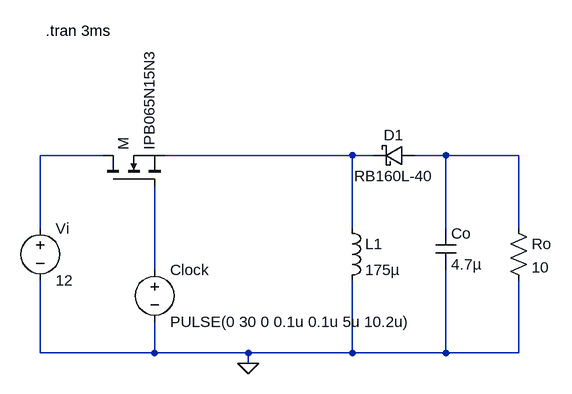
[diagram p0: schematic Buck-Boost Converter.asc]
Buck-Boost Converter.asc, the LTspice schematic file:
Version 4
SHEET 1 880 680
WIRE -288 -64 -384 -64
WIRE 96 -64 -192 -64
WIRE 128 -64 96 -64
WIRE 240 -64 192 -64
WIRE 352 -64 240 -64
WIRE -384 48 -384 -64
WIRE 96 48 96 -64
WIRE 240 48 240 -64
WIRE 352 48 352 -64
WIRE -208 112 -208 -16
WIRE -384 240 -384 128
WIRE -208 240 -208 192
WIRE -208 240 -384 240
WIRE -64 240 -208 240
WIRE 96 240 96 128
WIRE 96 240 -64 240
WIRE 240 240 240 112
WIRE 240 240 96 240
WIRE 352 240 352 128
WIRE 352 240 240 240
WIRE -64 256 -64 240
FLAG -64 256 0
SYMBOL nmos -288 -16 R270
SYMATTR InstName M
SYMATTR Value IPB065N15N3
SYMBOL cap 224 48 R0
SYMATTR InstName Co
SYMATTR Value 4.7µ
SYMBOL res 336 32 R0
SYMATTR InstName Ro
SYMATTR Value 10
SYMBOL voltage -208 96 R0
WINDOW 123 0 0 Left 2
WINDOW 39 0 0 Left 2
SYMATTR InstName Clock
SYMATTR Value PULSE(0 30 0 0.1u 0.1u 5u 10.2u)
SYMBOL voltage -384 32 R0
WINDOW 123 0 0 Left 2
WINDOW 39 0 0 Left 2
SYMATTR InstName Vi
SYMATTR Value 12
SYMBOL ind 80 32 R0
SYMATTR InstName L1
SYMATTR Value 175µ
SYMBOL schottky 192 -48 M270
WINDOW 0 32 32 VTop 2
WINDOW 3 0 32 VBottom 2
SYMATTR InstName D1
SYMATTR Value RB160L-40
SYMATTR Description Diode
SYMATTR Type diode
TEXT -376 -256 Left 2 !.tran 3ms

The netlist it stands for:
* Buck-Boost Converter.asc
M N001 N004 N002 N002 IPB065N15N3
Co N003 0 4.7µ
Ro N003 0 10
V§Clock N004 0 PULSE(0 30 0 0.1u 0.1u 5u 10.2u)
Vi N001 0 12
L1 N002 0 175µ
D1 N003 N002 RB160L-40
.model D D
.lib standard.dio
.model NMOS NMOS
.model PMOS PMOS
.lib standard.mos
.tran 3ms
.backanno
.end